# EasyEDA Pro project NerdvanaTaurus_FE.eprj

# Schematic MainBoard
Board Name: MainBoard; Create Date: 2025-05-30; Page Name: Sheet_1; Project Name: NerdvanaTaurus_FE; Schematic Name: MainBoard; Update Date: 2025-05-30; Add into BOM: yes; Company: -; Convert to PCB: yes; Date: 2025-02-01; Draw By: P.F.Andrei; REV: 1.0; Sheet: 1/1; spicePre: .
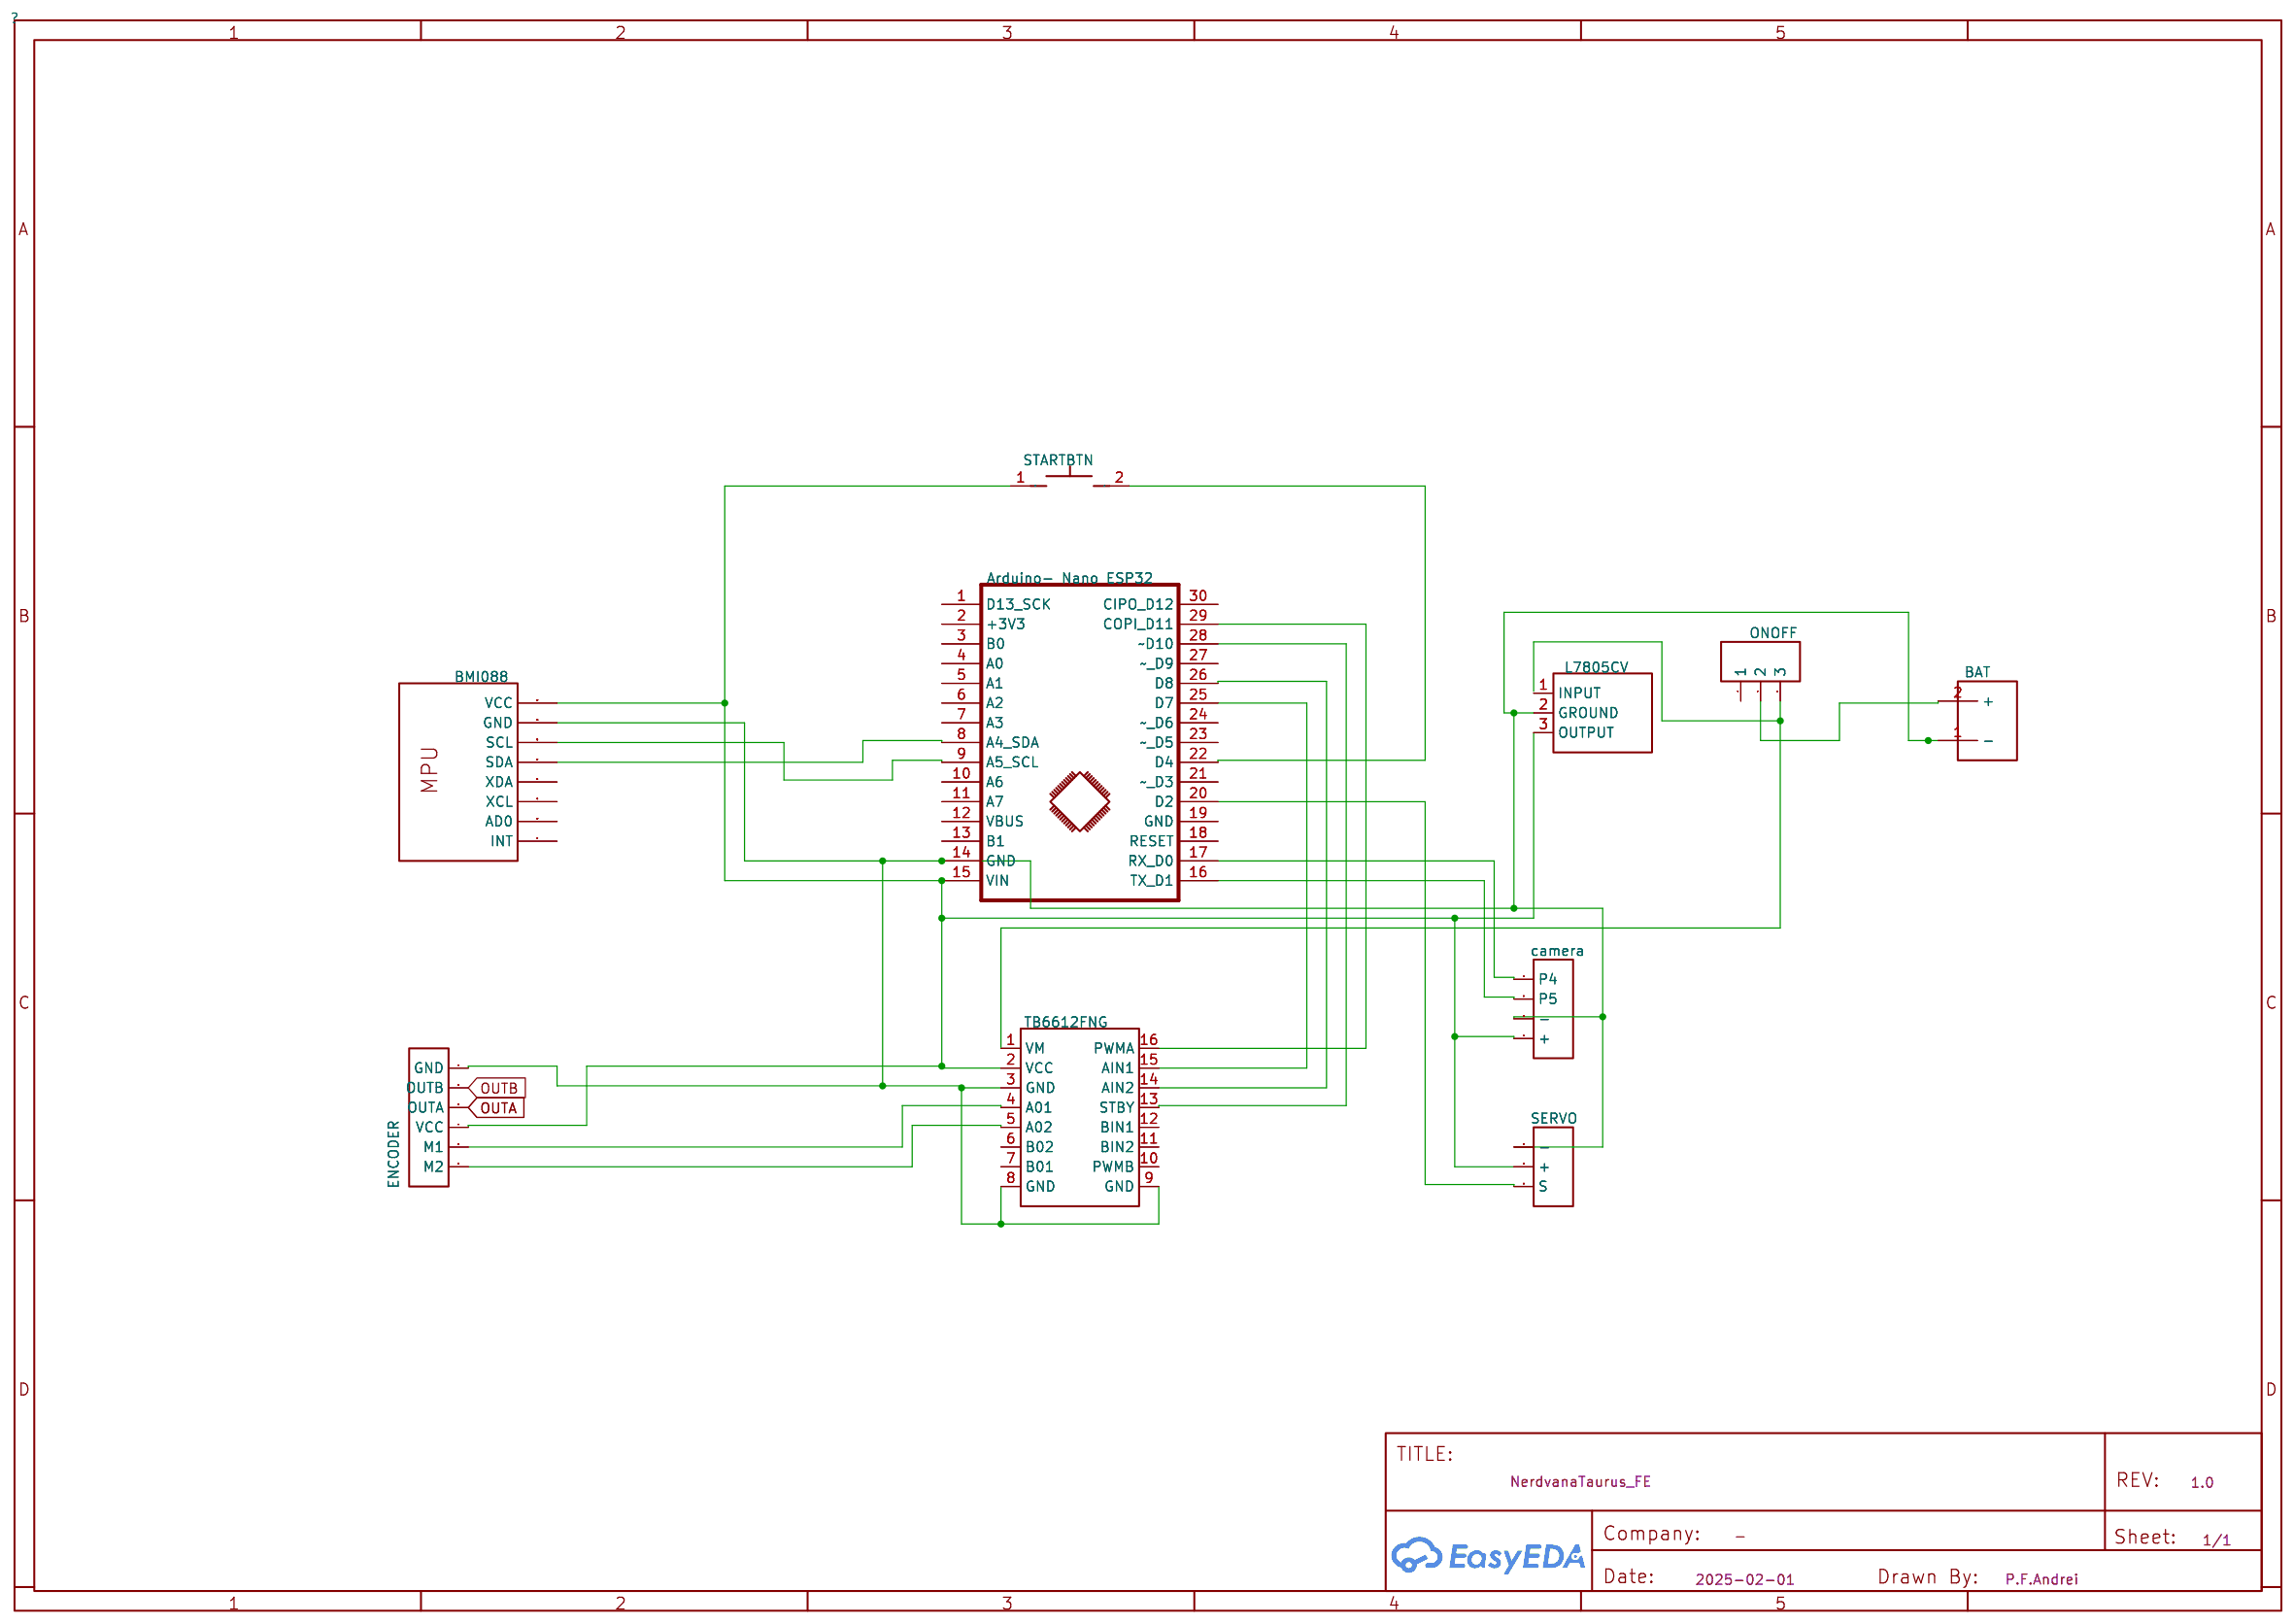
[diagram p0: schematic sheet]

## Parts
BAT1  BAT
CAM1  camera
H1  ENCODER
L1CV  L7805CV
M2  BMI088
ONOFF1  ONOFF
SERVO1  SERVO
START1  STARTBTN
U3  Arduino- Nano ESP32
U4  TB6612FNG

## Library data of the parts
BAT1 = BAT: Contributor: OFKLZ; spicePre: U; spiceSymbolName: VINPUT
CAM1 = camera: Supplier Part: C225501; Supplier: LCSC; Contributor: LCEDA_Lib; spicePre: H; spiceSymbolName: HDR-F-2.54_1x4
H1 = ENCODER: Supplier Part: C40877; Supplier: LCSC; Contributor: LCEDA_Lib; spicePre: H; spiceSymbolName: HDR-F-2.54_1x6
L1CV = L7805CV: Supplier: LCSC; Supplier Part: C2895294; Manufacturer: null; Manufacturer Part: L7805CV带散热器; JLCPCB Part Class: Extended Part; Contributor: LCSC; spicePre: U; spiceSymbolName: L7805CV_C2895294
M2 = MPU6050: timeStamp: 1462265206; sourceId: 1T5FDZYC8; Contributor: THE AS-Creation; spicePre: M
ONOFF1 = ONOFF: Supplier Part: C146690; Supplier: LCSC; Contributor: LCEDA_Lib; spicePre: H; spiceSymbolName: HDR-F-2.54_1x3
SERVO1 = SERVO: Supplier Part: C146690; Supplier: LCSC; Contributor: LCEDA_Lib; spicePre: H; spiceSymbolName: HDR-F-2.54_1x3
START1 = STARTBTN: Supplier: LCSC; Supplier Part: C9900005988; Manufacturer: null; Manufacturer Part: BUTTON2; JLCPCB Part Class: Extended Part; Contributor: LCSC; spicePre: U; spiceSymbolName: BUTTON2
U3 = Arduino® Nano ESP32: Manufacturer: Arduino; Manufacturer Part: ABX00092; Supplier Part: ABX00092; Supplier: Arduino; link: https://store.arduino.cc/products/nano-esp32; Contributor: jbdreamz365; spicePre: U
U4 = TB6612FNG: Contributor: sendme2vachan; spicePre: U; spiceSymbolName: TB6612FNG MOTOR DRIVER

## Nets
OUTA: H1.3(OUTA)
OUTB: H1.2(OUTB)
Net-(BAT1-1): BAT1.1(-) CAM1.3(-) H1.1(GND) L1CV.2(GROUND) M2.GND SERVO1.1(-) U3.14(GND) U4.3(GND) U4.8(GND) U4.9(GND)
Net-(BAT1-2): BAT1.2(+) ONOFF1.2
Net-(CAM1-1): CAM1.1(P4) U3.17(RX D0)
Net-(CAM1-2): CAM1.2(P5) U3.16(TX D1)
Net-(CAM1-4): CAM1.4(+) H1.4(VCC) L1CV.3(OUTPUT) M2.VCC SERVO1.2(+) START1.1 U3.15(VIN) U4.2(VCC)
Net-(H1-5): H1.5(M1) U4.4(A01)
Net-(H1-6): H1.6(M2) U4.5(A02)
Net-(M2-SCL): M2.SCL U3.9(A5 SCL)
Net-(M2-SDA): M2.SDA U3.8(A4 SDA)
Net-(ONOFF1-3): ONOFF1.3 U4.1(VM)
Net-(SERVO1-3): SERVO1.3(S) U3.20(D2)
Net-(START1-2): START1.2 U3.22(D4)
Net-(U3-25): U3.25(D7) U4.15(AIN1)
Net-(U3-26): U3.26(D8) U4.14(AIN2)
Net-(U3-28): U3.28(~D10) U4.13(STBY)
Net-(U3-29): U3.29(COPI D11) U4.16(PWMA)

Not connected (* = marked no-connect by the designer): L1CV 1(INPUT); M2 AD0 INT XCL XDA; ONOFF1 1; U3 1(D13 SCK) 2(+3V3) 3(B0) 4(A0) 5(A1) 6(A2) 7(A3) 10(A6) 11(A7) 12(VBUS) 13(B1) 18(RESET) 19(GND) 21(~ D3) 23(~ D5) 24(~ D6) 27(~ D9) 30(CIPO D12); U4 6(B02) 7(B01) 10(PWMB) 11(BIN2) 12(BIN1)

# Board MainBoardPCB
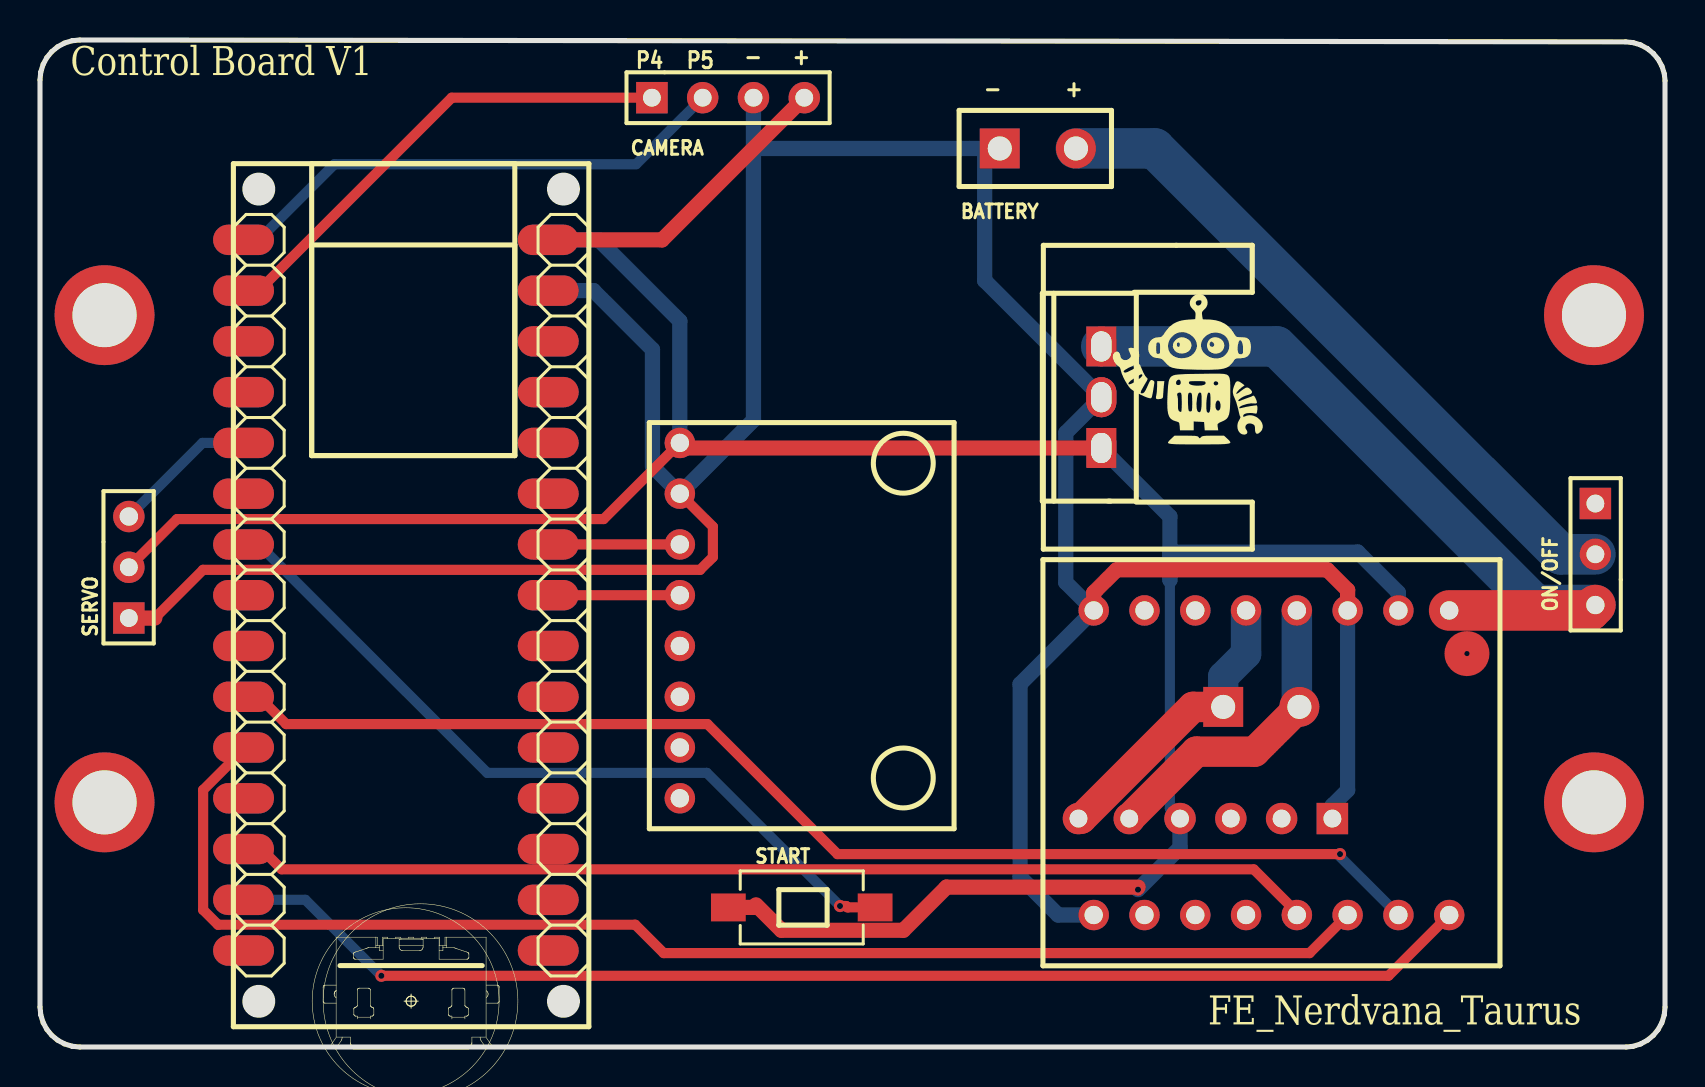
[diagram p1: board, top side]
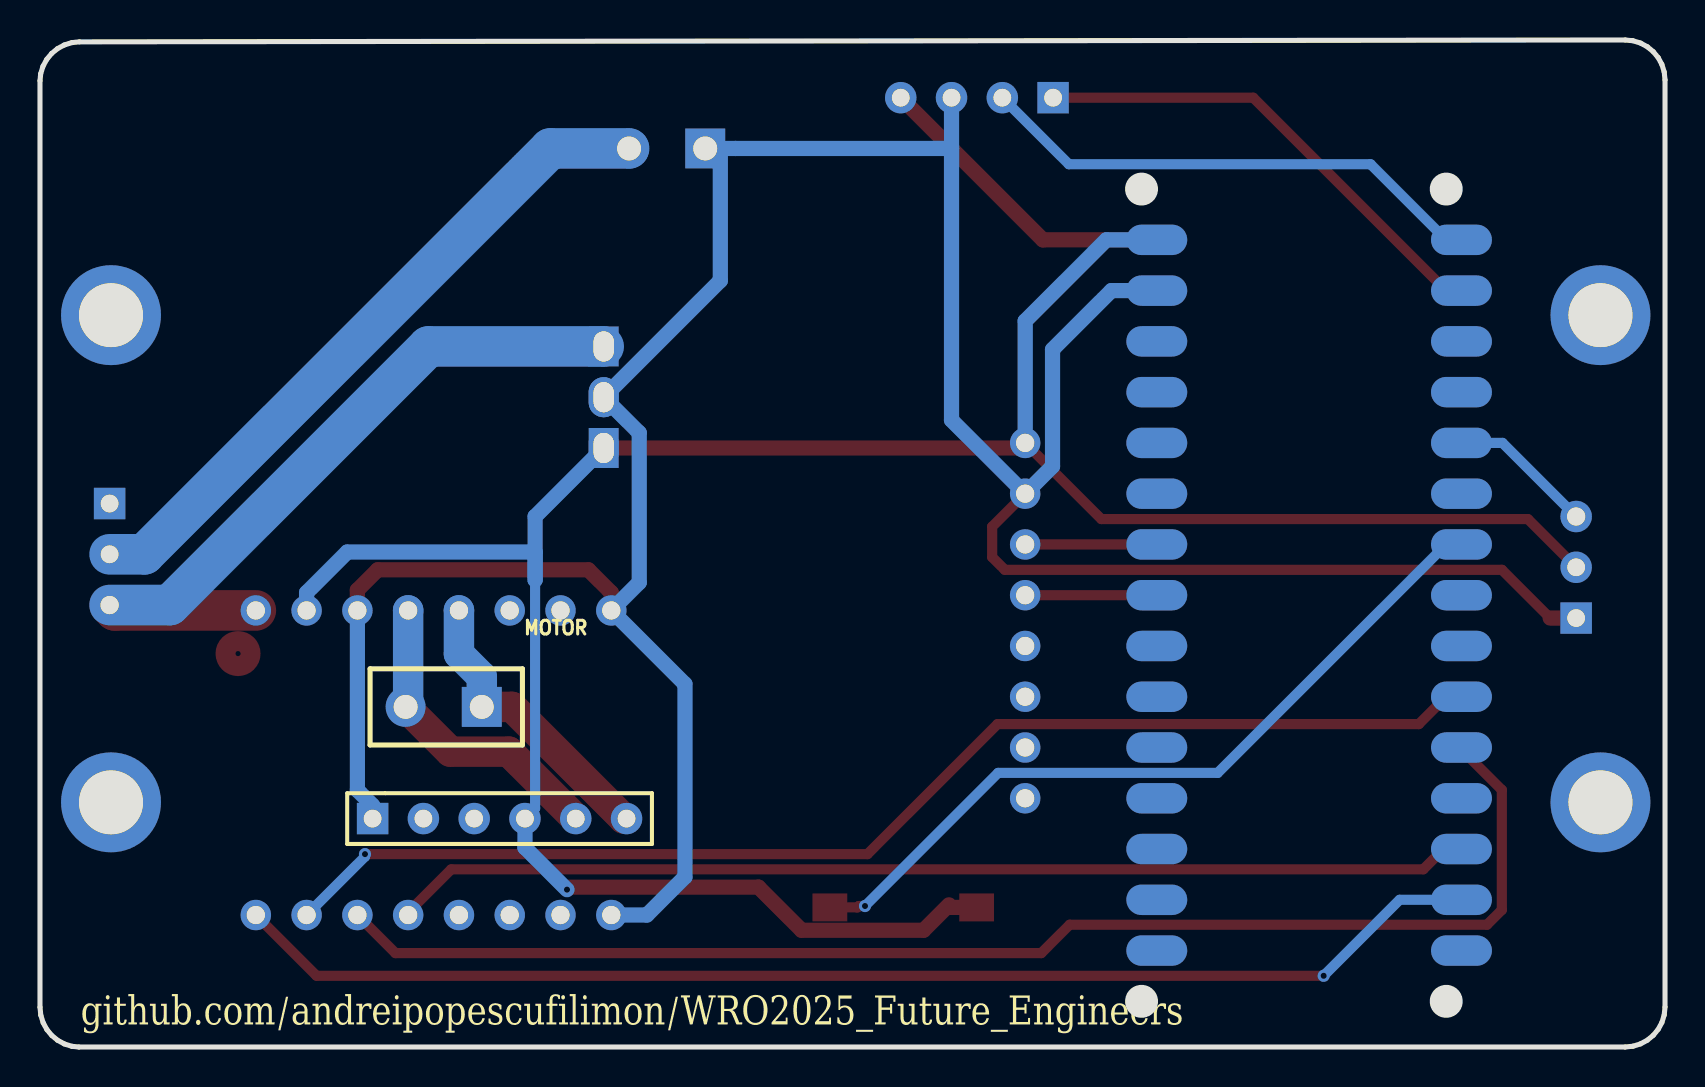
[diagram p2: board, bottom side, seen from below]

Outline 81.28 x 50.39 mm; copper layers: Top Layer, Bottom Layer. Coordinates in mm from the lower left corner of the outline.
Outline path: 0,48.39 0,2 0.04,1.6 0.16,1.22 0.34,0.88 0.59,0.59 0.88,0.34 1.22,0.16 1.6,0.04 2,0 79.33,0 79.68,0.04 80.06,0.15 80.4,0.34 80.69,0.58 80.94,0.88 81.12,1.22 81.24,1.59 81.28,1.99 81.28,48.35 81.24,48.7 81.13,49.07 80.94,49.41 80.7,49.71 80.4,49.95 80.06,50.14 79.69,50.25 79.31,50.29 1.99,50.39 1.6,50.35 1.22,50.23 0.88,50.05 0.59,49.8 0.34,49.5 0.16,49.16 0.04,48.79 0,48.39

## Design rules (mm)
via Default (default): diameter min 0.61, default 0.61, max 100.025; hole min 0.305, default 0.305, max 59.995

## Placement (name value [footprint] x y rotation side)
BATTERY  BAT  [VINPUT]  49.91 44.96 0 top
CAMERA  camera  [HDR-F-2.54_1X4]  34.42 47.5 0 top
H1  ENCODER  [HDR-F-2.54_1X6]  59.56 11.43 180 bottom
L1CV  L7805CV  [TO-220_L7805CV]  53.09 32.51 90 top
M2  MPU6050  [MPU6050-MODULE]  30.48 10.92 0 top
MOTOR  MOTOR  [VINPUT]  61.09 17.02 0 bottom
NOREF  -  [Pad_e254]  53.09 29.97 90 top
NOREF#2  -  [Pad_e256]  53.09 35.05 90 top
NOREF#3  -  [Pad_e251]  3.23 12.24 0 top
NOREF#4  -  [Pad_e252]  77.73 12.24 0 top
NOREF#5  -  [Pad_e250]  3.23 36.62 0 top
NOREF#6  -  [Pad_e253]  77.73 36.62 0 top
NOREF#7  -  [Pad_e255]  53.09 32.51 90 top
ON/OFF  ONOFF  [HDR-F-2.54_1X3]  77.8 24.65 270 top
SERVO  SERVO  [HDR-F-2.54_1X3]  4.45 24 90 top
START  STARTBTN  [SW-SMD_L6.0-W3.5-LS8.0-1]  38.1 6.99 0 top
U3  Arduino® Nano ESP32  [ARDUINO NANO ESP32]  18.67 1.02 180 top
U4  TB6612FNG  [TB6612FNG MOTOR DRIVER]  57.79 14.22 270 top

## Footprints (pads in the part's own frame, mm; a bottom-side part is the same pattern mirrored in y, then rotated)
ARDUINO NANO ESP32
  custom 3.045x1.524 hole 1.016x1.021: 1(-7.514,-3.81) 2(-7.514,-6.35) 3(-7.514,-8.89) 4(-7.514,-11.43) 5(-7.514,-13.97) 6(-7.514,-16.51) 7(-7.514,-19.05) 8(-7.514,-21.59) 9(-7.514,-24.13) 10(-7.514,-26.67) 11(-7.514,-29.21) 12(-7.514,-31.75) 13(-7.514,-34.29) 14(-7.514,-36.83) 15(-7.514,-39.37) 16(7.726,-39.37) 17(7.726,-36.83) 18(7.726,-34.29) 19(7.726,-31.75) 20(7.726,-29.21) 21(7.726,-26.67) 22(7.726,-24.13) 23(7.726,-21.59) 24(7.726,-19.05) 25(7.726,-16.51) 26(7.726,-13.97) 27(7.726,-11.43) 28(7.726,-8.89) 29(7.726,-6.35) 30(7.726,-3.81)
HDR-F-2.54_1X3
  rect 1.575x1.575 hole 0.889: 1(-2.54,0)
  round 1.575 hole 0.889: 2(0,0)
  round 1.575 hole 0.914: 3(2.54,0)
HDR-F-2.54_1X4
  rect 1.575x1.575 hole 0.889: 1(-3.81,0)
  round 1.575 hole 0.889: 2(-1.27,0) 3(1.27,0) 4(3.81,0)
HDR-F-2.54_1X6
  rect 1.575x1.575 hole 0.889: 1(-5.08,0)
  round 1.575 hole 0.889: 2(-2.54,0) 3(0,0) 4(2.54,0) 5(5.08,0) 6(7.62,0)
MPU6050-MODULE
  round 1.524 hole 0.914: AD0(1.524,4.064) GND(1.524,16.764) INT(1.524,1.524) SCL(1.524,14.224) SDA(1.524,11.684) VCC(1.524,19.304) XCL(1.524,6.604) XDA(1.524,9.144)
Pad_e250
  round 5 hole 3.205x3.2: 1(0,0)
Pad_e251
  round 5 hole 3.205x3.2: 1(0,0)
Pad_e252
  round 5 hole 3.205x3.2: 1(0,0)
Pad_e253
  round 5 hole 3.205x3.2: 1(0,0)
Pad_e254
  oval 2x1.5 hole 1.5x1: 3(0,0)
Pad_e255
  oval 2x1.5 hole 1.5x1: 2(0,0)
Pad_e256
  rect 2x1.5 hole 1.5x1: 1(0,0)
SW-SMD_L6.0-W3.5-LS8.0-1
  rect 1.74x1.4 smd: 1(-3.67,0) 2(3.67,0)
TB6612FNG MOTOR DRIVER
  round 1.524 hole 0.914: 1(-7.62,12.7) 2(-7.62,10.16) 3(-7.62,7.62) 4(-7.62,5.08) 5(-7.62,2.54) 6(-7.62,0) 7(-7.62,-2.54) 8(-7.62,-5.08) 9(7.62,-5.08) 10(7.62,-2.54) 11(7.62,0) 12(7.62,2.54) 13(7.62,5.08) 14(7.62,7.62) 15(7.62,10.16) 16(7.62,12.7)
TO-220_L7805CV
  rect 2x1.5 hole 1.5x1: 1(-2.54,0)
  oval 2x1.5 hole 1.5x1: 2(0,0) 3(2.54,0)
VINPUT
  rect 2x2 hole 1.2: 1(-1.905,0)
  round 2 hole 1.2: 2(1.905,0)

## Nets
5V: CAMERA.4 H1.4 L1CV.3 M2.VCC NOREF.3 SERVO.2 START.1 U3.15 U4.2
12V: L1CV.1 NOREF#2.1 ON/OFF.3 U4.1
12VIN: BATTERY.2 ON/OFF.2
GND: BATTERY.1 CAMERA.3 H1.1 L1CV.2 M2.GND NOREF#7.2 SERVO.1 U3.14 U4.3 U4.8 U4.9
A01: H1.5 MOTOR.2 U4.4
A02: H1.6 MOTOR.1 U4.5
AIN1: U3.25 U4.15
AIN2: U3.26 U4.14
CAMP4: CAMERA.1 U3.17
CAMP5: CAMERA.2 U3.16
GYROSCL: M2.SCL U3.9
GYROSDA: M2.SDA U3.8
M2_AD0: M2.AD0
M2_INT: M2.INT
M2_XCL: M2.XCL
M2_XDA: M2.XDA
ONOFF1_1: ON/OFF.1
OUTA: H1.3
OUTB: H1.2
PWMA: U3.29 U4.16
SERVO: SERVO.3 U3.20
STARTBTN: START.2 U3.22
STBY: U3.28 U4.13
U3_1: U3.1
U3_2: U3.2
U3_3: U3.3
U3_4: U3.4
U3_5: U3.5
U3_6: U3.6
U3_7: U3.7
U3_10: U3.10
U3_11: U3.11
U3_12: U3.12
U3_13: U3.13
U3_18: U3.18
U3_19: U3.19
U3_21: U3.21
U3_23: U3.23
U3_24: U3.24
U3_27: U3.27
U3_30: U3.30
U4_6: U4.6
U4_7: U4.7
U4_10: U4.10
U4_11: U4.11
U4_12: U4.12

Pads without a net: NOREF#3 1; NOREF#4 1; NOREF#5 1; NOREF#6 1

## Via types
v1: diameter 0.61, hole 0.305, Top Layer to Bottom Layer, 4 vias

## Routing (per net, layer and track width the routed paths; a pad name or vN(x,y) marks a point on that pad's centre or on a via; arc(x,y) is an arc through that point)
5V: length 140.7
  Top Layer w0.508: SERVO.2 6.86,26.42 28.19,26.42 M2.VCC
  Top Layer w0.762: CAMERA.4 31.11,40.39 26.18,40.39 ; M2.VCC 32.26,29.97 NOREF.3 ; 54.92,8 45.34,8 43.19,5.84 37.08,5.84 35.81,7.11 ; START.1 35.81,6.99
  Bottom Layer w0.508: H1.4 56.52,11.94 56.52,23.11
  Bottom Layer w0.762: H1.4 57.02,9.98 v1(54.92,7.87) ; U4.2 67.95,22.73 65.91,24.77 56.52,24.77 56.52,23.37 56.52,26.54 NOREF.3 ; 26.18,40.39 27.94,40.39 32,36.32 M2.VCC
12V: length 37.5
  Top Layer w2.032: U4.1 77.53,21.84 ON/OFF.3
  Bottom Layer w2.032: ON/OFF.3 74.79,22.11 61.85,35.05 NOREF#2.1
12VIN: length 34.4
  Bottom Layer w2.032: ON/OFF.2 76.06,24.65 55.75,44.96 BATTERY.2
GND: length 153.8
  Top Layer w0.508: 5.74,21.46 8.16,23.88 33.02,23.88 33.66,24.51 33.66,26.04 M2.GND
  Top Layer w0.762: U4.8 52.7,22.73 53.85,23.88 64.39,23.88 65.41,22.86 U4.3 ; SERVO.1 5.74,21.46
  Bottom Layer w0.508: BATTERY.1 47.25,44.96
  Bottom Layer w0.762: U4.9 50.93,6.6 49.02,8.51 49.02,18.16 U4.8 51.31,23.24 51.31,30.73 L1CV.2 47.25,38.35 47.25,44.96 35.69,44.96 ; U4.3 65.41,12.85 64.64,12.09 H1.1 ; 35.69,44.96 35.69,31.37 M2.GND 30.64,29.06 30.64,34.9 27.69,37.85 26.18,37.85 ; 35.69,44.96 CAMERA.3
A01: length 15.7
  Top Layer w1.524: MOTOR.2 60.75,14.78 57.83,14.78 54.48,11.43
  Bottom Layer w1.524: 62.86,21.84 62.86,17.15 MOTOR.2
A02: length 14.9
  Top Layer w1.524: H1.6 52.08,11.43 57.67,17.02 MOTOR.1
  Bottom Layer w1.524: U4.5 60.33,19.67 59.18,18.53 MOTOR.1
AIN1: length 61.6
  Top Layer w0.508: v1(65.02,9.65) 39.89,9.65 33.39,16.16 12.31,16.16 U3.25
  Bottom Layer w0.508: v1(65.02,9.65) 65.02,9.53 U4.15
AIN2: length 68.6
  Top Layer w0.508: U4.14 63.5,4.7 31.2,4.7 29.78,6.12 8.9,6.12 8.16,6.86 8.16,12.87 10.28,14.99 10.94,14.99
CAMP4: length 23.7
  Top Layer w0.508: U3.17 20.6,47.5 CAMERA.1
CAMP5: length 25.1
  Bottom Layer w0.508: 10.94,40.39 14.73,44.17 29.82,44.17 CAMERA.2
GYROSCL: length 5.8
  Top Layer w0.508: U3.9 M2.SCL
GYROSDA: length 5.8
  Top Layer w0.508: U3.8 M2.SDA
PWMA: length 62.4
  Top Layer w0.508: U4.16 67.45,3.56 v1(17.07,3.56)
  Bottom Layer w0.508: v1(17.07,3.56) 13.27,7.37 U3.29
SERVO: length 8
  Bottom Layer w0.508: SERVO.3 8.13,30.23 10.94,30.23
STARTBTN: length 38.4
  Top Layer w0.508: START.2 40.39,6.99 40.32,7.05 v1(40.02,7.05)
  Bottom Layer w0.508: U3.22 22.37,13.72 33.35,13.72 v1(40.02,7.05)
STBY: length 53.3
  Top Layer w0.508: 62.87,6.73 60.71,8.89 12.09,8.89 10.95,10.03

## Text on the board
Bottom Silkscreen Layer: github.com/andreipopescufilimon/WRO2025_Future_Engineers
Top Silkscreen Layer: P4 | P5 | - | + | Control Board V1 | FE_Nerdvana_Taurus
